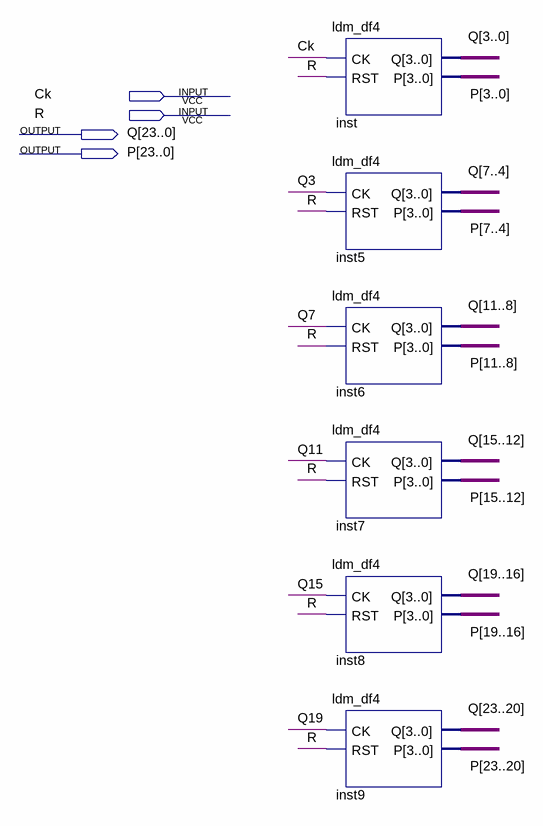
[diagram p0: schematic sheet]
// Quartus schematic ldm_df24.bdf as structural Verilog: 6 symbols, 4 pins
module ldm_df24 (
  input  Ck,
  input  R,
  output [23:0] Q,
  output [23:0] P
);

  ldm_df4 inst (.CK(Ck), .RST(R), .Q(Q[3:0]), .P(P[3:0]));
  ldm_df4 inst5 (.CK(Q[3]), .RST(R), .Q(Q[7:4]), .P(P[7:4]));
  ldm_df4 inst6 (.CK(Q[7]), .RST(R), .Q(Q[11:8]), .P(P[11:8]));
  ldm_df4 inst7 (.CK(Q[11]), .RST(R), .Q(Q[15:12]), .P(P[15:12]));
  ldm_df4 inst8 (.CK(Q[15]), .RST(R), .Q(Q[19:16]), .P(P[19:16]));
  ldm_df4 inst9 (.CK(Q[19]), .RST(R), .Q(Q[23:20]), .P(P[23:20]));
endmodule
